# EAGLE design AS5048B_Encoder_board (EAGLE 6.3)
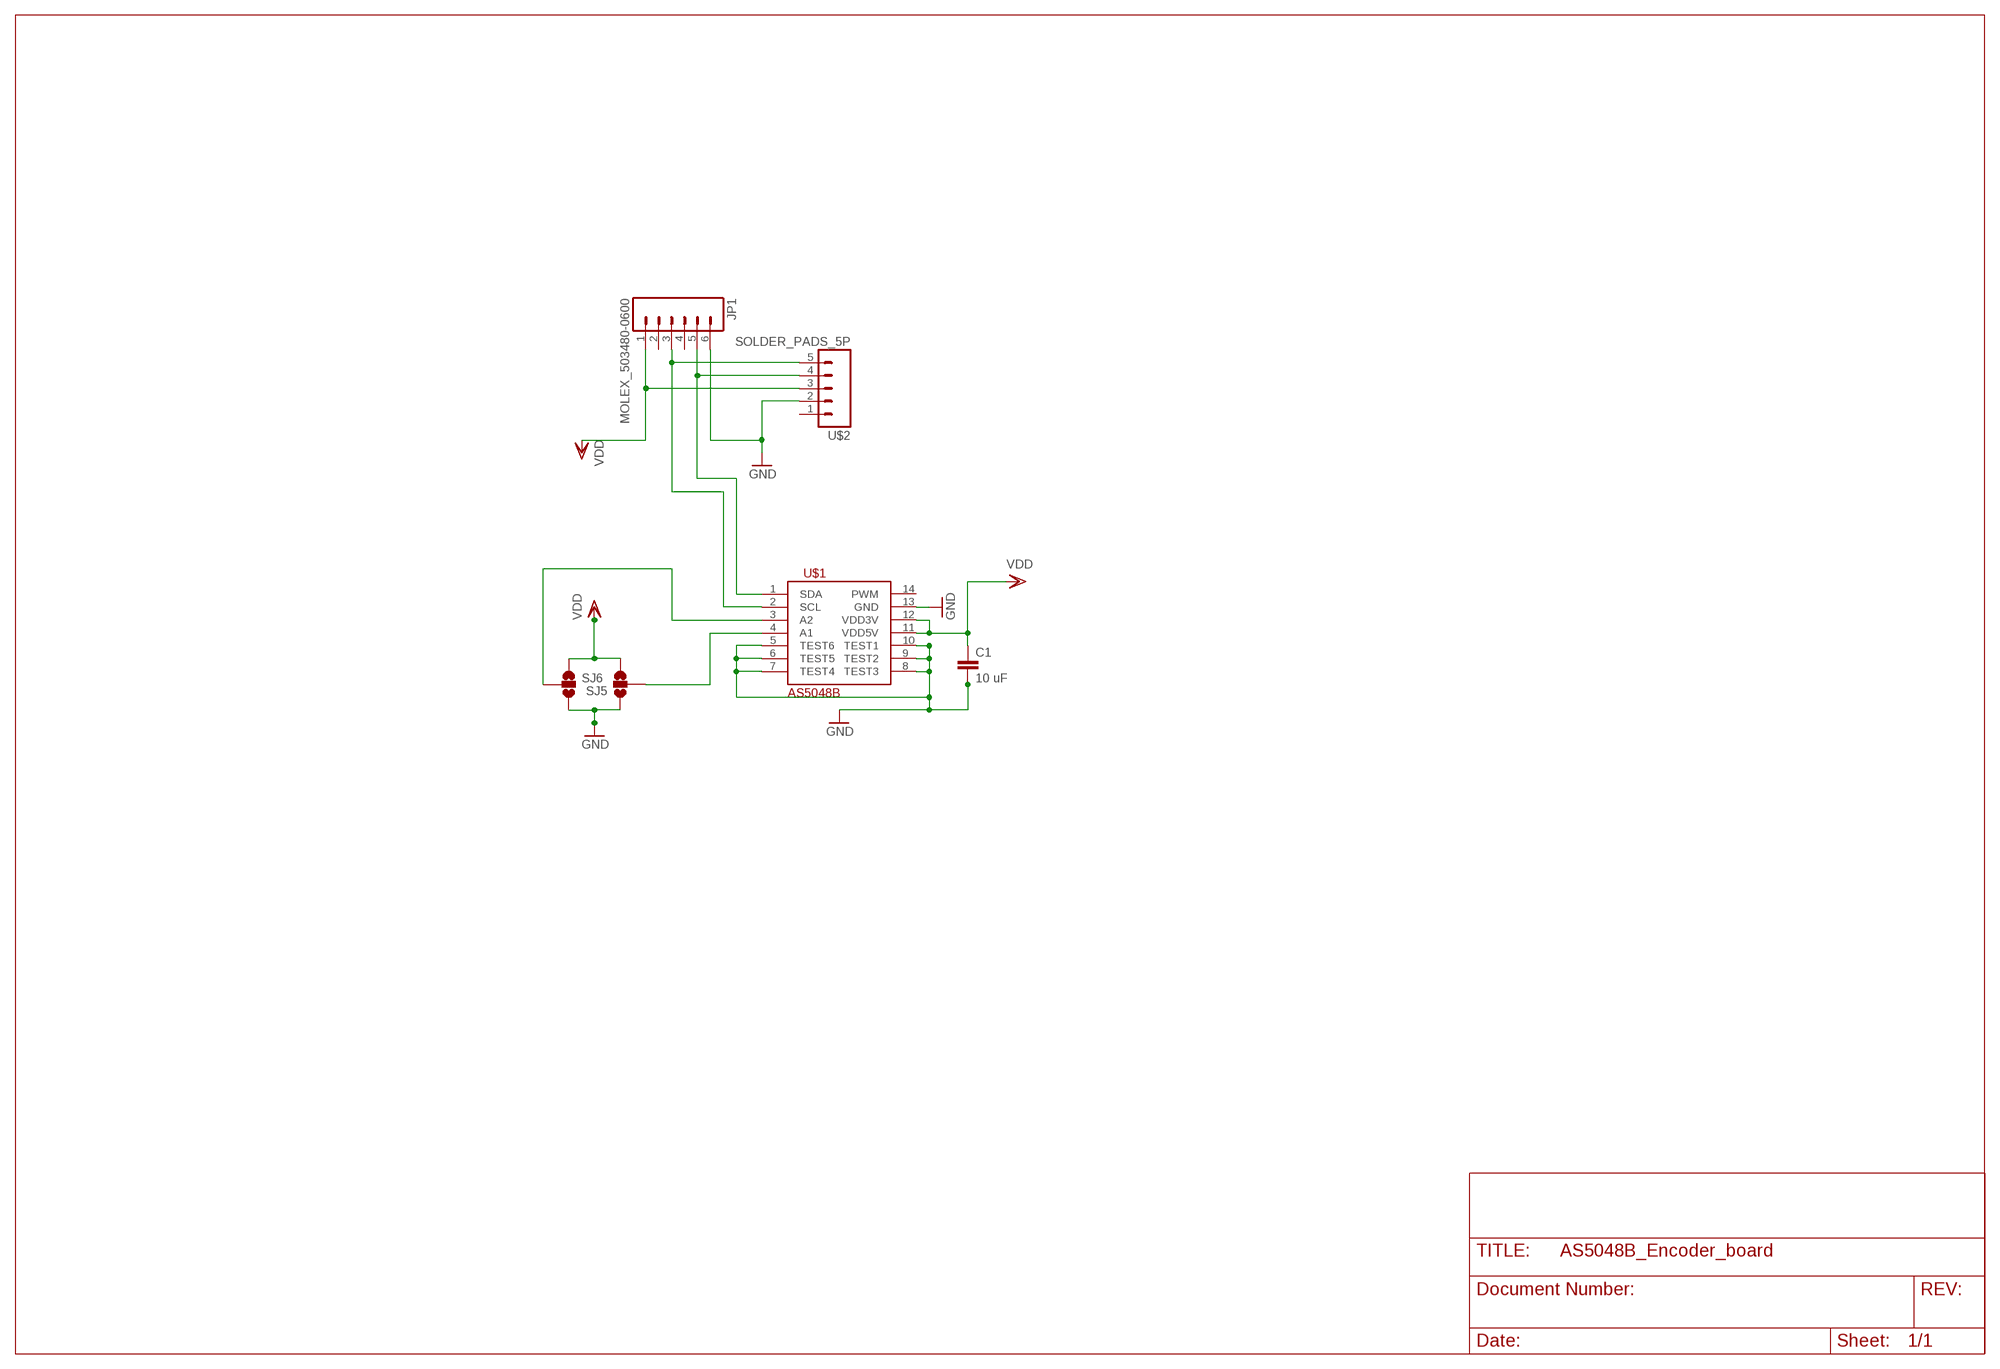
[diagram p0: schematic, sheet 1]

## Parts
C1  10 uF  CAP0603-CAP  [0603-CAP]
JP1  MOLEX_503480-0600  [MOLEX_503480-0600]
SJ5  SOLDERJUMPER_2WAYS  [SJ_3]
SJ6  SOLDERJUMPER_2WAYS  [SJ_3]
U$1  AS5048B  [TSSOP14]
U$2  SOLDER_PADS_5P  [SOLDER_PADS_5P]

## Nets
A1: SJ5.2 U$1.4(A1)
A2: SJ6.2 U$1.3(A2)
GND: C1.2 JP1.6 SJ5.1 SJ6.3 U$1.5(TEST6) U$1.6(TEST5) U$1.7(TEST4) U$1.8(TEST3) U$1.9(TEST2) U$1.10(TEST1) U$1.13(GND) U$2.2
SCL: JP1.3 U$1.2(SCL) U$2.5
SDA: JP1.5 U$1.1(SDA) U$2.4
VDD: C1.1 JP1.1 SJ5.3 SJ6.1 U$1.11(VDD5V) U$1.12(VDD3V) U$2.3
Unconnected: JP1.2 JP1.4 U$1.14(PWM) U$2.1

## Library data of the parts
C1 = SparkFun:CAP: Capacitor Standard 0603 ceramic capacitor, and 0.1" leaded capacitor.
JP1 = biomimetic:MOLEX_503480-0600
SJ5 SJ6 = SparkFun:SOLDERJUMPER_2WAY: Solder Jumper 2 way solder jumper
U$1 = austriamicrosystems:AS5048B
U$2 = stan:SOLDER_PADS_5P

## Board
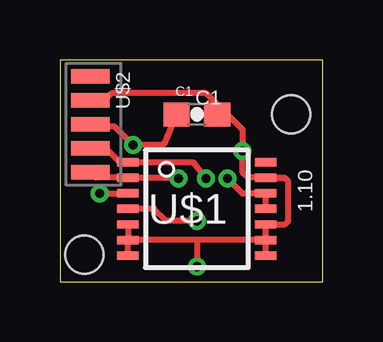
[diagram p1: board, top side]
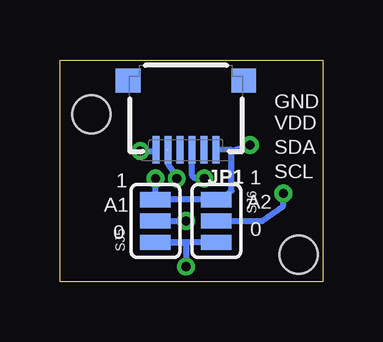
[diagram p2: board, bottom side, seen from below]

Size 10.97 x 9.26 mm. Coordinates in mm from the lower left corner, seen from the top.
Outline: 0,0 10.97,0 10.97,9.26 0,9.26 0,0
Copper layers (1*16): Top 2mil / dielectric 27mil / Bottom 2mil
Design rules "advancedcircuits-standard-biomimetic": minimum track width 5mil, minimum drill 10mil, track to track 5mil, track to pad 5mil, pad to pad 5mil, via to via 5mil, smd to smd 5mil, copper to edge 0.256540625mm, drill to drill 0.256540625mm, minimum pad ring 0.180340625mm, minimum via ring 0.180340625mm, stop-mask expansion 2mil, vias tented up to drill 0mil, thermal gap 10mil
Holes 1.59 mm at 1.02,1.14 9.65,6.99

### Footprints (pad centres in the part's own frame; a part is rotated, then mirrored left to right if it is on the bottom)
0603-CAP = smd 1.1 x 1: 1 -0.85,0; 2 0.85,0
MOLEX_503480-0600 = smd 0.3 x 1.15: 1 -1.25,1.725; 2 -0.75,1.725; 3 -0.25,1.725; 4 0.25,1.725; 5 0.75,1.725; 6 1.25,1.725 | smd 1.035 x 1: L -2.408,-1.15; R 2.408,-1.15
SJ_3 = smd 0.635 x 1.27: 1 -0.889,0; 2 0,0; 3 0.889,0
TSSOP14 = smd 0.9 x 0.35: 1 -2.875,1.95; 2 -2.875,1.3; 3 -2.875,0.65; 4 -2.875,0; 5 -2.875,-0.65; 6 -2.875,-1.3; 7 -2.875,-1.95; 8 2.875,-1.95; 9 2.875,-1.3; 10 2.875,-0.65; 11 2.875,0; 12 2.875,0.65; 13 2.875,1.3; 14 2.875,1.95
SOLDER_PADS_5P = smd 0.6 x 1.6: 1 -1.97,-0.005; 2 -0.97,-0.005; 3 0.03,-0.005; 4 1.03,-0.005; 5 2.03,-0.005

### Placement (x,y rotation side)
C1  5.71,6.99 0 top
JP1  5.71,7.24 180 bottom
SJ5  6.99,2.54 90 bottom
SJ6  4.44,2.54 270 bottom
U$1  5.71,3.05 0 top
U$2  1.27,6.6 270 top

### Tracks (layer width: path | path; a pad name or v marks a point on that pad's centre or on a via)
A1  (via drill 0.38 pad 0.25)
  Top 0.254: v5.71,2.54 4.44,2.54 3.94,3.05 U$1.4
  Bottom 0.254: SJ5.2 v5.71,2.54
A2  (via drill 0.38 pad 0.25)
  Top 0.254: v1.65,3.68 2.83,3.68 U$1.3
  Bottom 0.254: SJ6.2 2.54,2.54 1.65,3.17 v1.65,3.68
GND  (via drill 0.38, 0.38 pad 0.25)
  Top 0.254: U$1.5 U$1.6 | U$1.7 U$1.6 | U$1.8 U$1.9 | U$1.9 U$1.10 9.38,2.4 9.53,2.54 9.53,4.19 9.4,4.32 | 5.71,1.75 U$1.6 | U$1.9 5.71,1.75 | 5.71,1.75 v5.71,0.64 | 9.4,4.32 8.62,4.32 U$1.13 | U$1.13 9.37,4.35 9.4,4.32 | U$1.13 7.84,4.35 7.62,4.57 v7.62,5.46 7.62,6.35 6.99,6.99 C1.2 6.57,7.41 6.1,7.87 2.16,7.87 1.78,7.49 1.35,7.49 U$2.2
  Bottom 0.254: SJ6.3 SJ5.1 5.84,1.65 5.71,1.52 v5.71,0.64 | v7.62,5.46 6.96,5.46 JP1.6
SCL  (via drill 0.38 pad 0.25)
  Top 0.254: v4.95,4.32 4.86,4.35 U$1.2 1.49,4.35 U$2.5
  Bottom 0.254: v4.95,4.32 5.33,4.32 5.46,4.45 5.46,4.83 JP1.3
SDA  (via drill 0.38)  (1 unrouted)
  Top 0.254: v6.1,4.32 5.54,5 U$1.1 2.5,5 1.91,5.59 1.28,5.59 U$2.4
  Bottom 0.254: v6.1,4.32 6.22,4.57 6.48,4.95 6.48,5.5
VDD  (via drill 0.38)
  Top 0.254: U$1.11 U$1.12 8.58,3.68 7.62,3.68 v6.99,4.32 | U$2.3 1.36,6.48 2.29,6.48 v3.05,5.72 4.32,5.72 C1.1
  Bottom 0.254: v6.99,4.32 SJ5.3 SJ6.1 4.19,3.43 3.81,3.81 3.81,5.46 | JP1.1 3.81,5.49 3.81,5.46 | 3.81,5.46 v3.05,5.72

### Text on the board
tPlace: C1 | 1.10
bPlace: GND | VDD | SDA | SCL | 1 | 1 | A2 | A1 | 0 | 0